# Altium schematic sheet Comunicacao.SchDoc
size A4
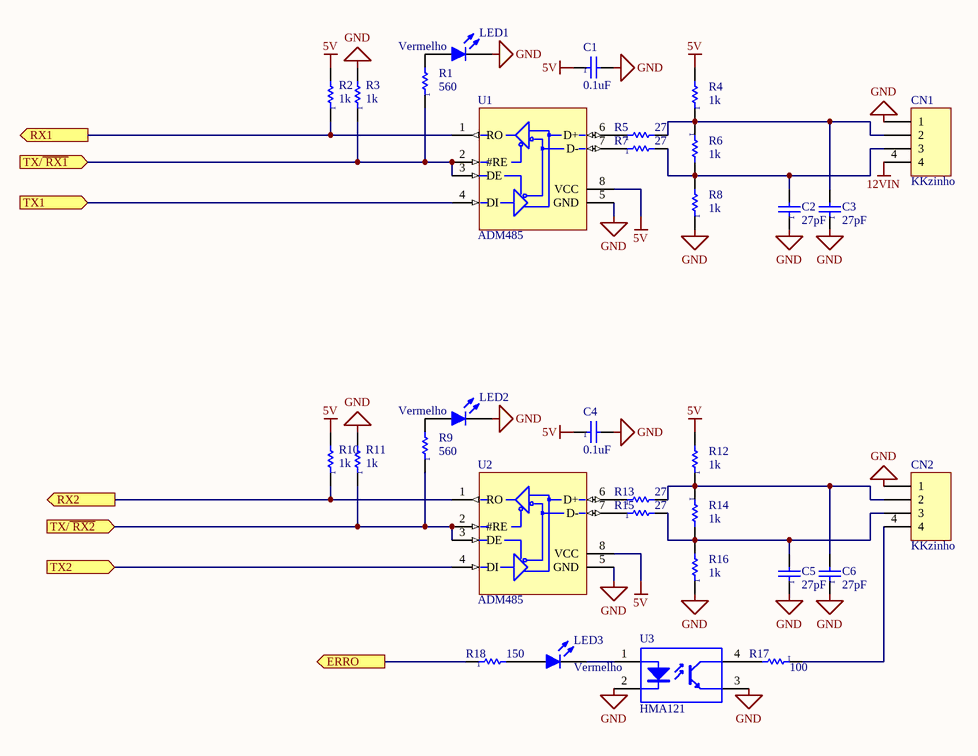
[diagram p0: Comunicacao.SchDoc]

## Parts
C1  0.1uF  [SMD_0805]
C2  27pF  [SMD_0805]
C3  27pF  [SMD_0805]
C4  0.1uF  [SMD_0805]
C5  27pF  [SMD_0805]
C6  27pF  [SMD_0805]
CN1  KKzinho  [KK4 - 2.54mm]
CN2  KKzinho  [KK4 - 2.54mm]
LED1  Vermelho  [LED_SMD_0805]
LED2  Vermelho  [LED_SMD_0805]
LED3  Vermelho  [LED_SMD_0805]
R1  560  [SMD_0805]
R2  1k  [SMD_0805]
R3  1k  [SMD_0805]
R4  1k  [SMD_0805]
R5  27  [SMD_0805]
R6  1k  [SMD_0805]
R7  27  [SMD_0805]
R8  1k  [SMD_0805]
R9  560  [SMD_0805]
R10  1k  [SMD_0805]
R11  1k  [SMD_0805]
R12  1k  [SMD_0805]
R13  27  [SMD_0805]
R14  1k  [SMD_0805]
R15  27  [SMD_0805]
R16  1k  [SMD_0805]
R17  100  [SMD_0805]
R18  150  [SMD_0805]
U1  ADM485  [SO-8_SO-G8/E2.5]
U2  ADM485  [SO-8_SO-G8/E2.5]
U3  HMA121  [SO4]

## Ports
ERRO (out), RX1 (out), RX2 (out), TX1 (in), TX2 (in), TX/~{ RX1} (in), TX/~{ RX2} (in)

## Nets
5V: C1.1 C4.1 R2.2 R4.2 R10.2 R12.2 U1.8(VCC) U2.8(VCC)
12VIN: CN1.4
GND: C1.2 C2.1 C3.1 C4.2 C5.1 C6.1 CN1.1 CN2.1 LED1.2(K) LED2.2(K) R3.2 R8.1 R11.2 R16.1 U1.5(GND) U2.5(GND) U3.2(K) U3.3(E)
ERRO: R18.1 ; port ERRO
RX1: R2.1 U1.1(RO) ; port RX1
RX2: R10.1 U2.1(RO) ; port RX2
TX1: U1.4(DI) ; port TX1
TX2: U2.4(DI) ; port TX2
TX/~{ RX1}: R1.1 R3.1 U1.2(#RE) U1.3(DE) ; port TX/~{ RX1}
TX/~{ RX2}: R9.1 R11.1 U2.2(#RE) U2.3(DE) ; port TX/~{ RX2}
NetC2_2: C2.2 CN1.3 R6.2 R7.2 R8.2
NetC3_2: C3.2 CN1.2 R4.1 R5.2 R6.1
NetC5_2: C5.2 CN2.3 R14.2 R15.2 R16.2
NetC6_2: C6.2 CN2.2 R12.1 R13.2 R14.1
NetCN2_4: CN2.4 R17.1
NetLED1_1: LED1.1(A) R1.2
NetLED2_1: LED2.1(A) R9.2
NetLED3_1: LED3.1(A) R18.2
NetLED3_2: LED3.2(K) U3.1(A)
NetR5_1: R5.1 U1.6(D+)
NetR7_1: R7.1 U1.7(D-)
NetR13_1: R13.1 U2.6(D+)
NetR15_1: R15.1 U2.7(D-)
NetR17_2: R17.2 U3.4(C)

## Library data of the parts
C1-C6 = Cap: Capacitor; Manufacturer: Generic Components; Class I: Passive; Revision: July-2002: Re-released for DXP Platform.; Class II: Capacitor; Value: *
CN1 CN2 = KK4: Conector Linear tipo KK de 4 vias
LED1-LED3 = Led: Manufacturer: Generic Components; Class I: Optoelectronic; Published: 8-Jun-2000; Revision: July-2002: Re-released for DXP Platform.; Publisher: Altium Limited; Class II: LED
R1-R18 = Res: Resistor; Class I: Passive; Revision: July-2002: Re-released for DXP Platform.; Class II: Resistor; Value: *
U1 U2 = RS485: Differential bus transceiver (MAX485 - SN75176)
U3 = HMA: Phototransistor Optocoupler SMD full Pptch mini-flat type; Manufacturer: Generic Components; Class I: Optoelectronic; Published: 24-Mar-1999; Revision: July-2002: Re-released for DXP Platform.; Publisher: Altium Limited